# EasyEDA schematic 1-Schematic_MicroCubeSat_B.json
TITLE: MicroCubeSat_B; REV: 1.0; Date: 2025-03-27; Sheet: 1/1; Drawn By: cookiealpha; Company: MIARI
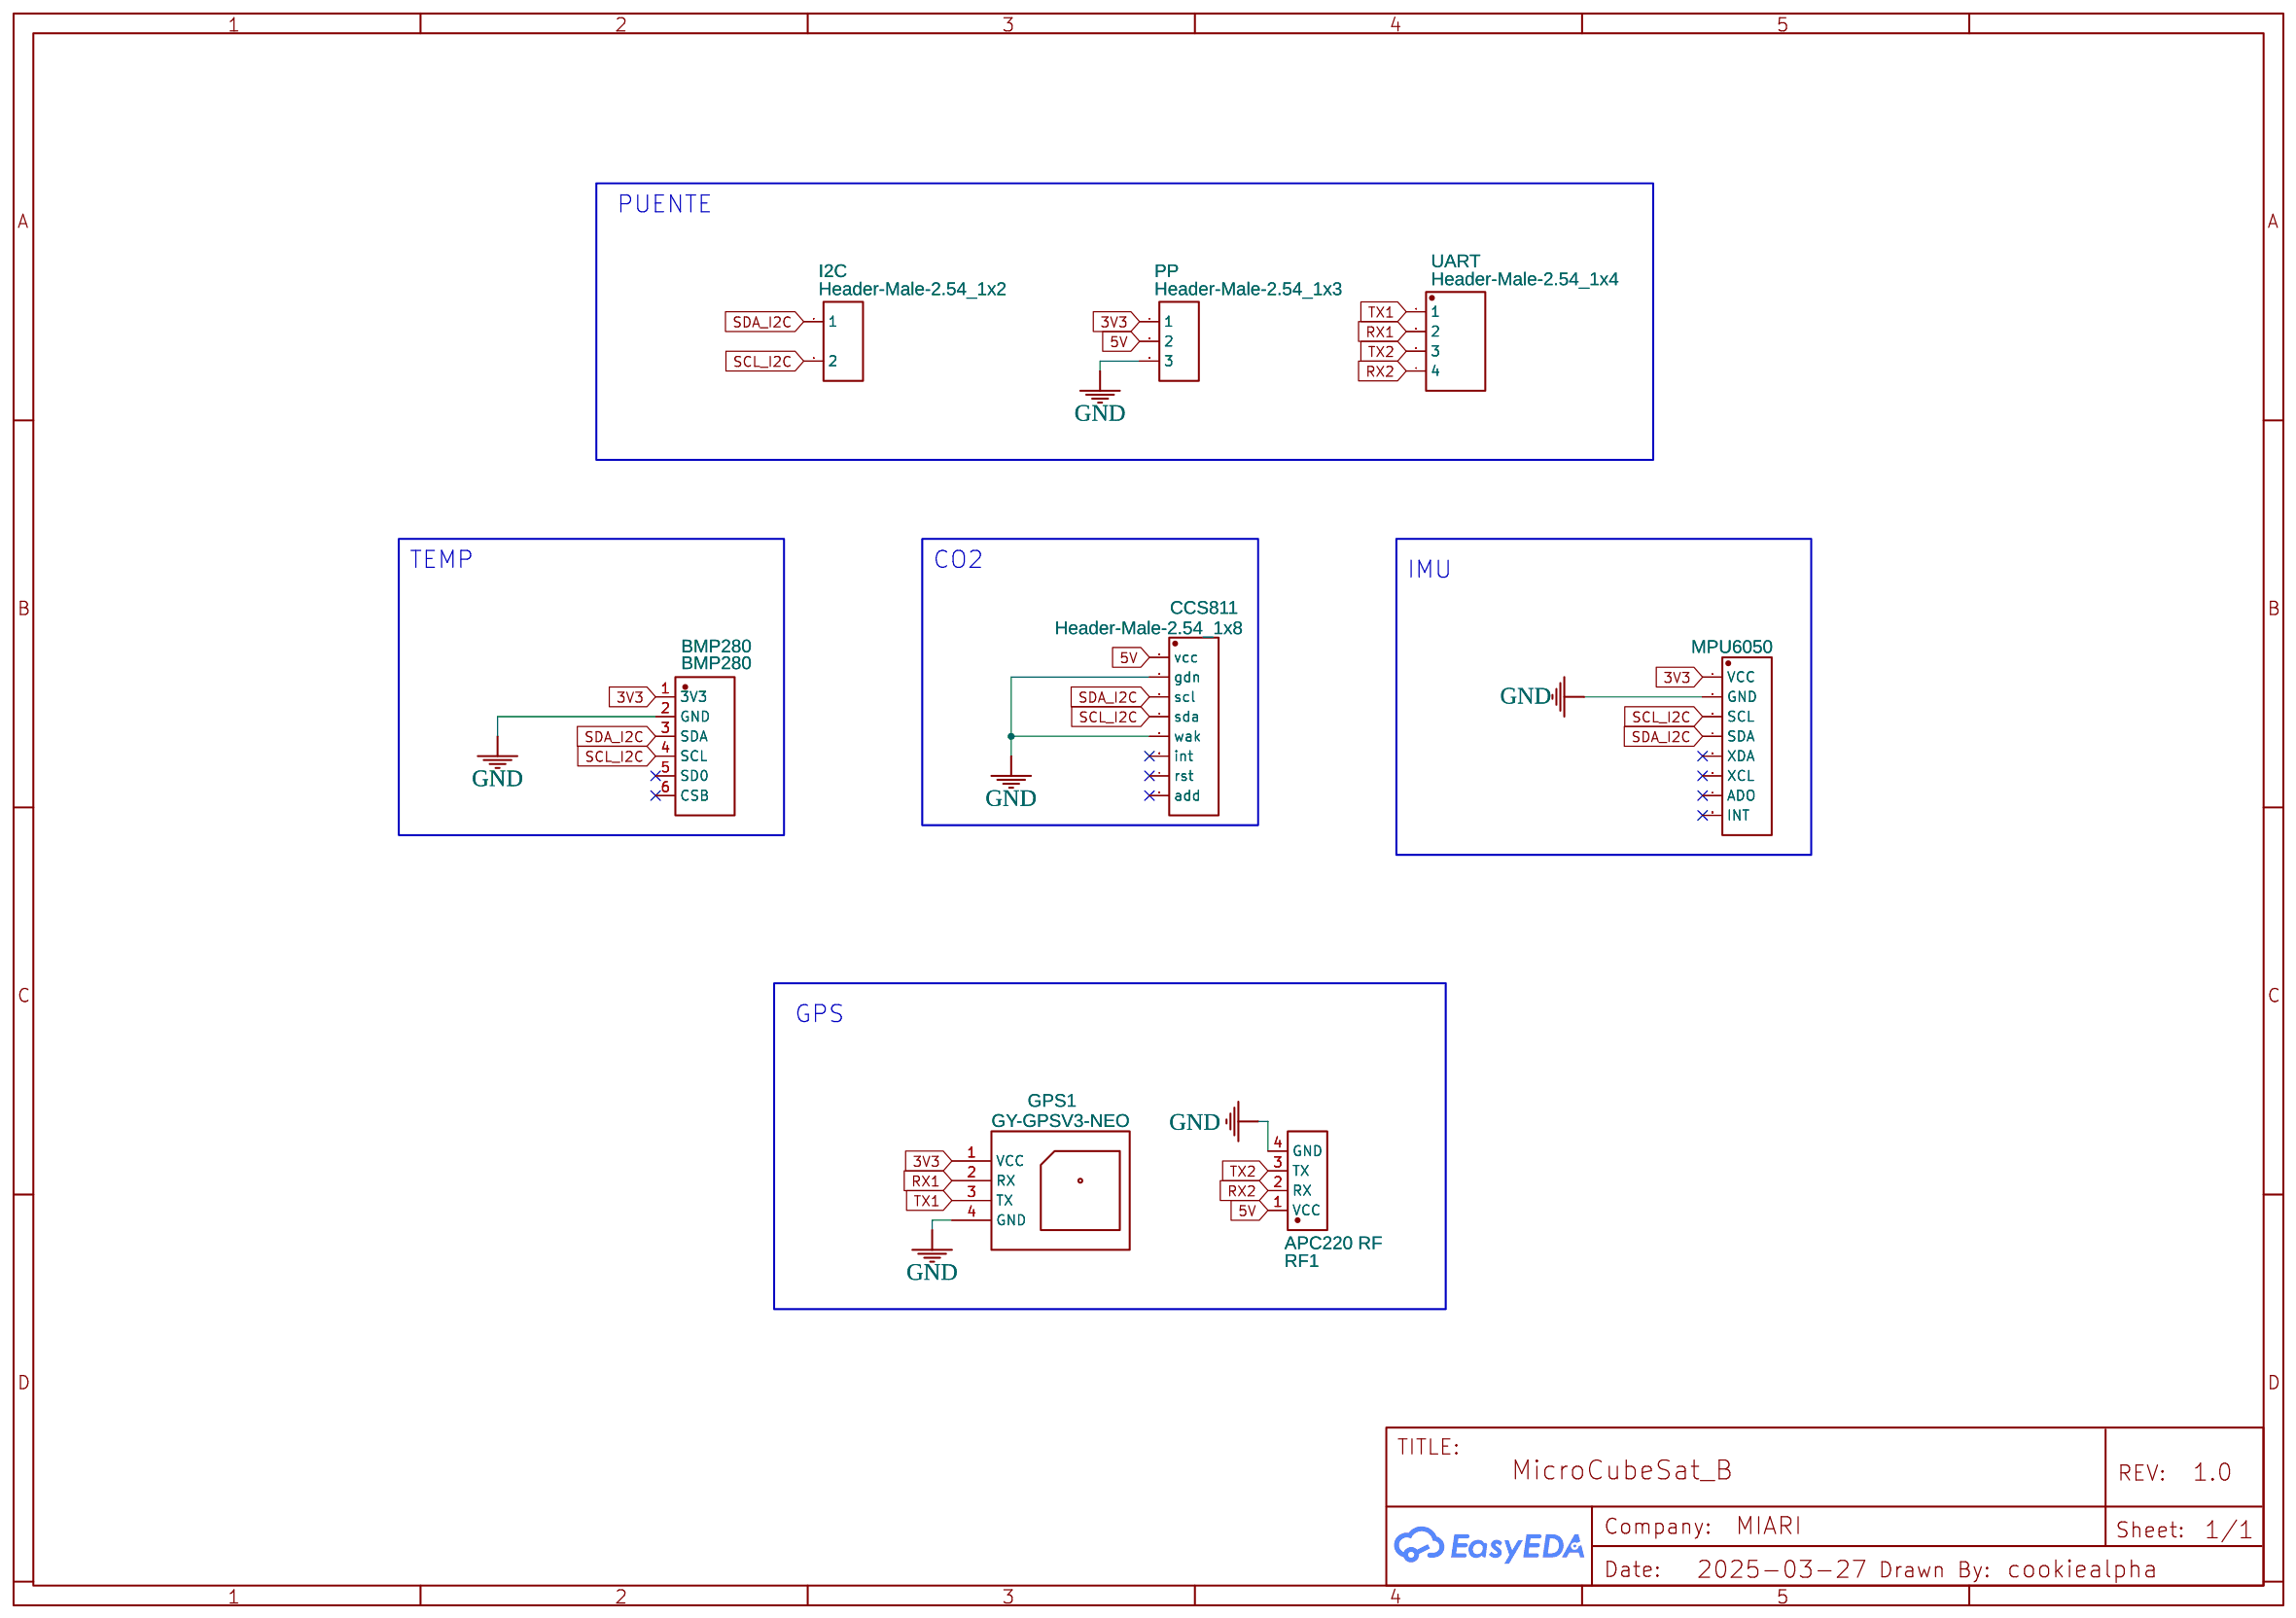
[diagram p0: schematic sheet]

## Parts
BMP280  BMP280  [COMM-TH_BMP280-TH]
CCS811  Header-Male-2.54_1x8  [HDR-TH_8P-P2.54-V-M]
GPS1  GY-GPSV3-NEO  [GY-GPSV3-NEO]
I2C  Header-Male-2.54_1x2  [HDR-TH_2P-P2.54-V-M-1]
IMU1  MPU6050  [HDR-TH_8P-P2.54-V-M]
PP  Header-Male-2.54_1x3  [HDR-TH_3P-P2.54-V-M-1]
RF1  APC220 RF  [HDR-TH_4P-P2.54-V-M-1]
UART  Header-Male-2.54_1x4  [HDR-TH_4P-P2.54-V-M]

## Library data of the parts
BMP280 = BMP280_C9900132626: Supplier: LCSC; Supplier Part: C9900132626; Manufacturer: null; Contributor: lcsc
CCS811 IMU1 = Header-Male-2.54_1x8: Contributor: LCSC; Supplier: LCSC; Manufacturer: Ckmtw(灿科盟); Manufacturer Part: B-2100S08P-A110; Supplier Part: C124381; JLCPCB Part Class: Extended Part
GPS1 = GY-GPSV3-NEO: Contributor: hern
I2C = Header-Male-2.54_1x2: Supplier: LCSC; Manufacturer: TE Connectivity(泰科电子); Manufacturer Part: 826629-2; Supplier Part: C86471; JLCPCB Part Class: Extended Part
PP = Header-Male-2.54_1x3: Supplier: LCSC; Manufacturer: BOOMELE(博穆精密); Manufacturer Part: 2.54-1*3P针; Supplier Part: C49257; JLCPCB Part Class: Extended Part
RF1 = HEADER_1*4P: Contributor: LCSC; Supplier: LCSC; Supplier Part: C9900003200; Manufacturer: null; JLCPCB Part Class: Extended Part
UART = Header-Male-2.54_1x4: Contributor: LCSC; Supplier: LCSC; Manufacturer: Ckmtw(灿科盟); Manufacturer Part: B-2100S04P-A110; Supplier Part: C124378; JLCPCB Part Class: Extended Part

## Nets
3V3: BMP280.1(3V3) GPS1.1(VCC) IMU1.1(VCC) PP.1
5V: CCS811.1(vcc) PP.2 RF1.1(VCC)
GND: BMP280.2(GND) CCS811.2(gdn) CCS811.5(wak) GPS1.4(GND) IMU1.2(GND) PP.3 RF1.4(GND)
RX1: GPS1.2(RX) UART.2
RX2: RF1.2(RX) UART.4
SCL_I2C: BMP280.4(SCL) CCS811.4(sda) I2C.2 IMU1.3(SCL)
SDA_I2C: BMP280.3(SDA) CCS811.3(scl) I2C.1 IMU1.4(SDA)
TX1: GPS1.3(TX) UART.1
TX2: RF1.3(TX) UART.3

Not connected (* = marked no-connect by the designer): BMP280 5(SD0)* 6(CSB)*; CCS811 6(int)* 7(rst)* 8(add)*; IMU1 5(XDA)* 6(XCL)* 7(ADO)* 8(INT)*

## Notes on the sheet
- PUENTE
- TEMP
- CO2
- IMU
- GPS
